# Altium schematic sheet 05_05_mux_schem.SchDoc
size 101 x 81 mm
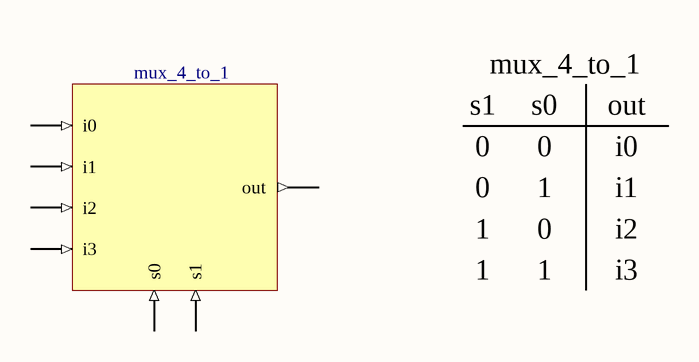
[diagram p0: 05_05_mux_schem.SchDoc]

## Parts
U8  mux_4_to_1

## Nets

Not connected (* = marked no-connect by the designer): U8 i0 i1 i2 i3 out s0 s1

## Notes on the sheet
- mux_4_to_1
- s1
- 0
- s0
- out
- i0
- 1
- i1
- i2
- i3